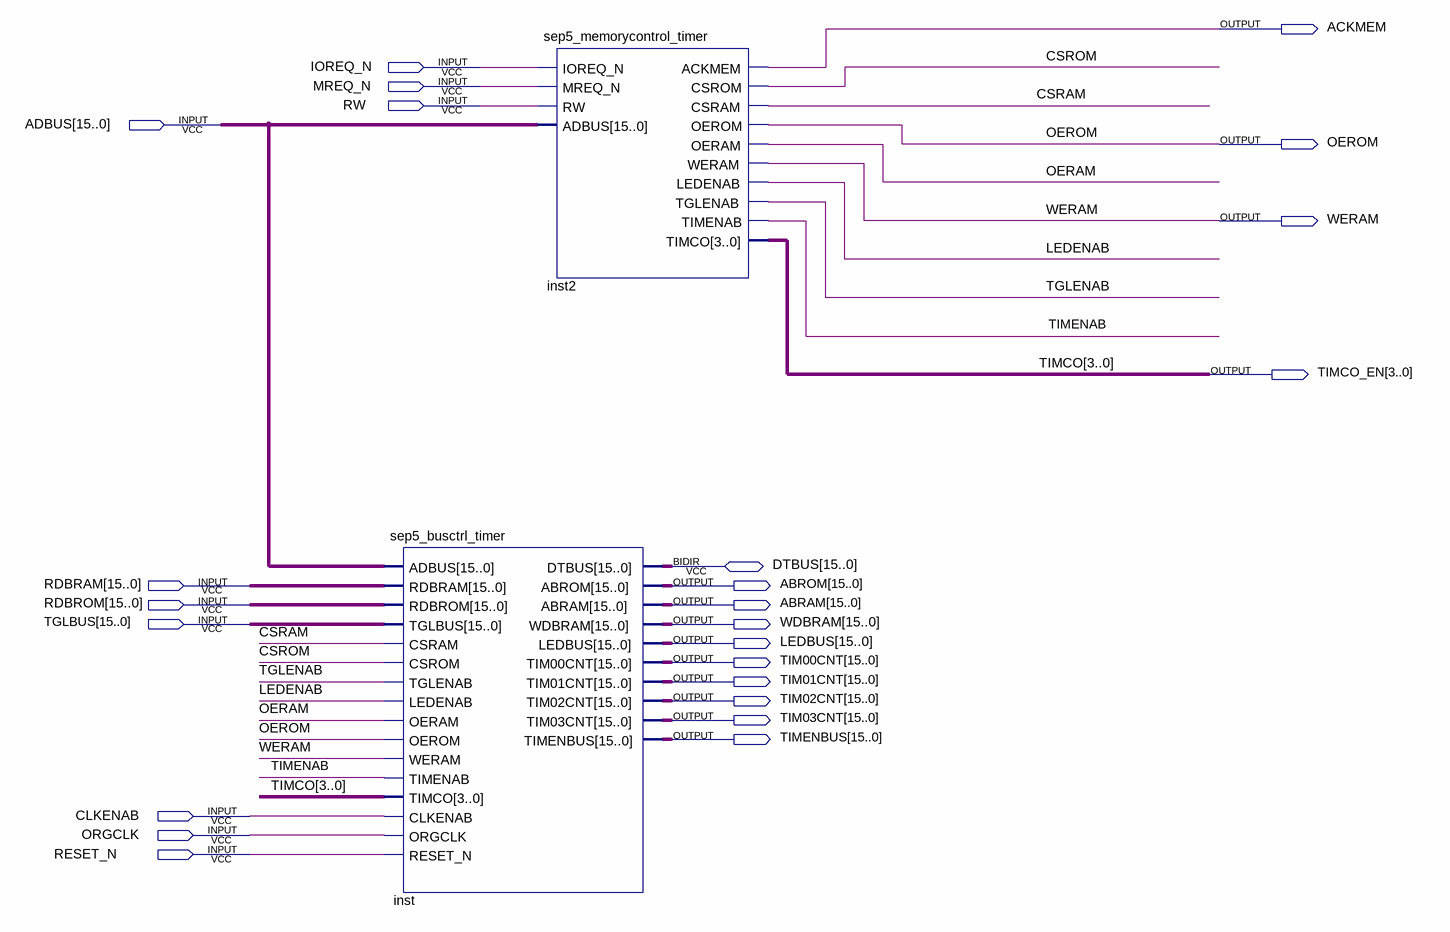
[diagram p0: schematic sheet]
// Quartus schematic sep5_memoryaccess_timer.bdf as structural Verilog: 2 symbols, 24 pins
module sep5_memoryaccess_timer (
  input  IOREQ_N,
  input  MREQ_N,
  input  RW,
  input  [15:0] ADBUS,
  input  [15:0] RDBRAM,
  input  [15:0] RDBROM,
  input  [15:0] TGLBUS,
  input  CLKENAB,
  input  ORGCLK,
  input  RESET_N,
  inout  [15:0] DTBUS,
  output ACKMEM,
  output OEROM,
  output WERAM,
  output [3:0] TIMCO_EN,
  output [15:0] ABROM,
  output [15:0] ABRAM,
  output [15:0] WDBRAM,
  output [15:0] LEDBUS,
  output [15:0] TIM00CNT,
  output [15:0] TIM01CNT,
  output [15:0] TIM02CNT,
  output [15:0] TIM03CNT,
  output [15:0] TIMENBUS
);

  wire CSRAM, CSROM, LEDENAB, OERAM, TGLENAB, TIMENAB;

  sep5_busctrl_timer inst (
    .ADBUS(ADBUS), .RDBRAM(RDBRAM), .RDBROM(RDBROM), .TGLBUS(TGLBUS), .CSRAM(CSRAM), .CSROM(CSROM),
    .TGLENAB(TGLENAB), .LEDENAB(LEDENAB), .OERAM(OERAM), .OEROM(OEROM), .WERAM(WERAM), .TIMENAB(TIMENAB),
    .TIMCO(TIMCO_EN), .CLKENAB(CLKENAB), .ORGCLK(ORGCLK), .RESET_N(RESET_N), .ABROM(ABROM), .ABRAM(ABRAM),
    .WDBRAM(WDBRAM), .LEDBUS(LEDBUS), .TIM00CNT(TIM00CNT), .TIM01CNT(TIM01CNT), .TIM02CNT(TIM02CNT),
    .TIM03CNT(TIM03CNT), .TIMENBUS(TIMENBUS), .DTBUS(DTBUS));
  sep5_memorycontrol_timer inst2 (
    .IOREQ_N(IOREQ_N), .MREQ_N(MREQ_N), .RW(RW), .ADBUS(ADBUS), .ACKMEM(ACKMEM), .CSROM(CSROM),
    .CSRAM(CSRAM), .OEROM(OEROM), .OERAM(OERAM), .WERAM(WERAM), .LEDENAB(LEDENAB), .TGLENAB(TGLENAB),
    .TIMENAB(TIMENAB), .TIMCO(TIMCO_EN));

  // Other names for the same wires on the sheet: TIMCO[3:0] = TIMCO_EN
endmodule
